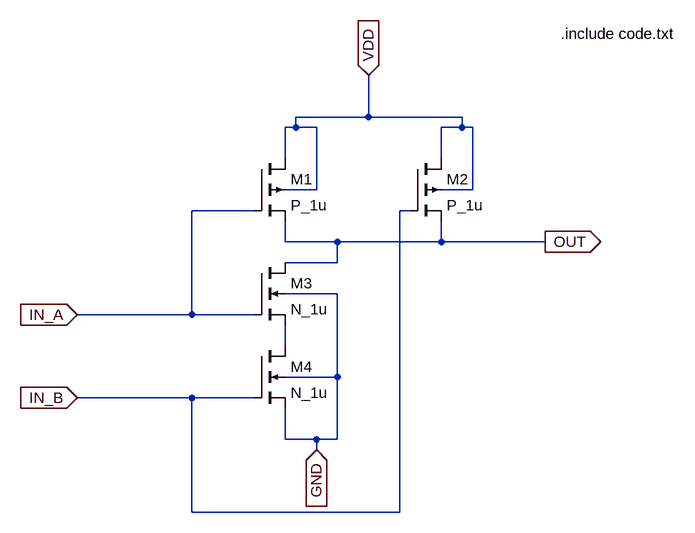
[diagram p0: schematic Circuit2_Part1_NANDUsingMosfets.asc]
Circuit2_Part1_NANDUsingMosfets.asc, the LTspice schematic file:
Version 4
SHEET 1 880 848
WIRE 240 0 240 -64
WIRE 240 0 128 0
WIRE 384 0 240 0
WIRE 128 16 128 0
WIRE 128 16 112 16
WIRE 160 16 128 16
WIRE 384 16 384 0
WIRE 384 16 352 16
WIRE 400 16 384 16
WIRE 112 64 112 16
WIRE 352 64 352 16
WIRE 160 112 160 16
WIRE 160 112 112 112
WIRE 400 112 400 16
WIRE 400 112 352 112
WIRE 64 144 -32 144
WIRE 304 144 288 144
WIRE 112 192 112 160
WIRE 192 192 112 192
WIRE 352 192 352 160
WIRE 352 192 192 192
WIRE 512 192 352 192
WIRE 192 224 192 192
WIRE 192 224 112 224
WIRE 192 272 112 272
WIRE -32 304 -32 144
WIRE -32 304 -208 304
WIRE 64 304 -32 304
WIRE 112 352 112 320
WIRE 192 400 192 272
WIRE 192 400 112 400
WIRE -32 432 -208 432
WIRE 64 432 -32 432
WIRE 112 496 112 448
WIRE 160 496 112 496
WIRE 192 496 192 400
WIRE 192 496 160 496
WIRE 160 512 160 496
WIRE -32 608 -32 432
WIRE 288 608 288 144
WIRE 288 608 -32 608
FLAG -208 304 IN_A
IOPIN -208 304 In
FLAG -208 432 IN_B
IOPIN -208 432 In
FLAG 512 192 OUT
IOPIN 512 192 Out
FLAG 240 -64 VDD
IOPIN 240 -64 In
FLAG 160 512 GND
IOPIN 160 512 In
SYMBOL pmos4 64 64 R0
SYMATTR InstName M1
SYMATTR Value P_1u
SYMATTR Value2 l=1u w=10u
SYMBOL pmos4 304 64 R0
SYMATTR InstName M2
SYMATTR Value P_1u
SYMATTR Value2 l=1u w=10u
SYMBOL nmos4 64 224 R0
SYMATTR InstName M3
SYMATTR Value N_1u
SYMATTR Value2 l=1u w=10u
SYMBOL nmos4 64 352 R0
SYMATTR InstName M4
SYMATTR Value N_1u
SYMATTR Value2 l=1u w=10u
TEXT 536 -128 Left 2 !.include code.txt

The netlist it stands for:
* Circuit2_Part1_NANDUsingMosfets.asc
M1 VDD IN_A OUT VDD P_1u l=1u w=10u
M2 VDD IN_B OUT VDD P_1u l=1u w=10u
M3 OUT IN_A N001 GND N_1u l=1u w=10u
M4 N001 IN_B GND GND N_1u l=1u w=10u
.model NMOS NMOS
.model PMOS PMOS
.lib standard.mos
.include code.txt
.backanno
.end